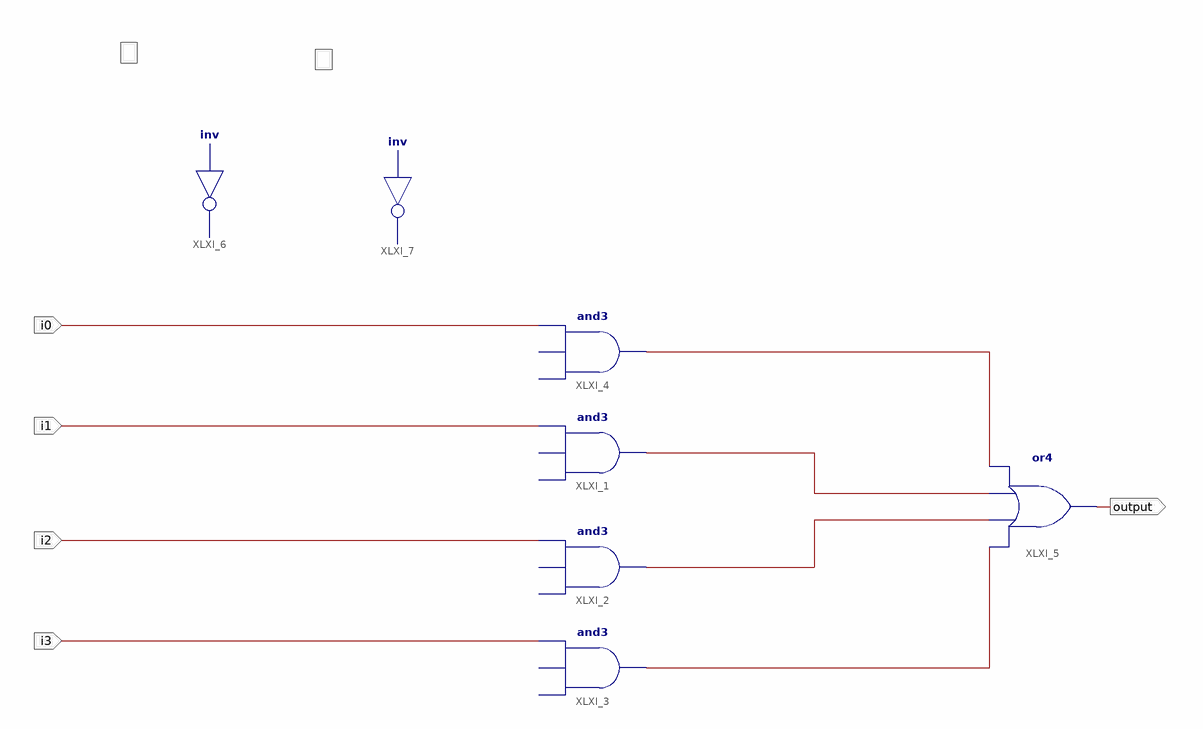
[diagram p0: schematic sheet 1]
// Xilinx ISE schematic multiplexer.sch (spartan3e) as structural Verilog: 7 symbols, 5 ports
module multiplexer (
  input  i0,
  input  i1,
  input  i2,
  input  i3,
  output \output 
);

  wire XLXN_1, XLXN_2, XLXN_3, XLXN_4;

  buf XLXI_1 (XLXN_1, i1);  // and3 open: I0, I1
  buf XLXI_2 (XLXN_2, i2);  // and3 open: I0, I1
  buf XLXI_3 (XLXN_3, i3);  // and3 open: I0, I1
  buf XLXI_4 (XLXN_4, i0);  // and3 open: I0, I1
  or XLXI_5 (\output , XLXN_3, XLXN_2, XLXN_1, XLXN_4);
  // inv XLXI_6 is placed but not wired
  // inv XLXI_7 is placed but not wired
endmodule
